# Altium schematic sheet User Interface.SchDoc: User Interface
size A4; Date: 2016/01/05; Author: Samuel López; DocumentNumber: 6; SheetNumber: 6; SheetTotal: 7; Project: H2H Main Board
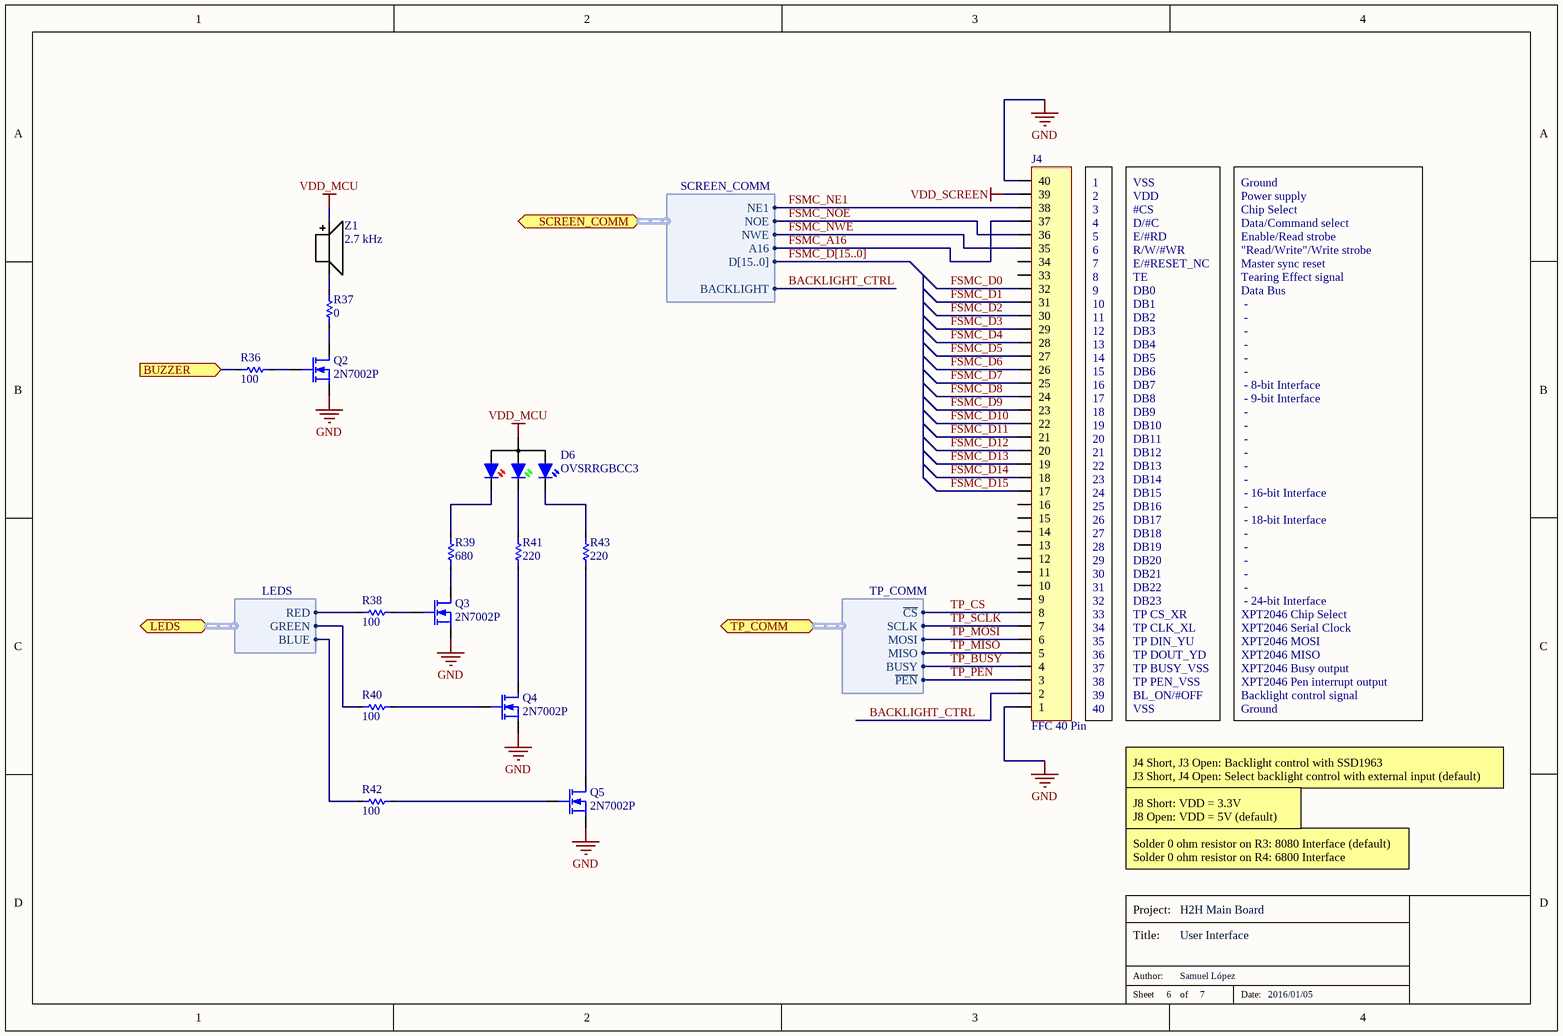
[diagram p0: User Interface.SchDoc]

## Parts
D6  OVSRRGBCC3  [OVSRRGBCC3/SIDE]
J4  FFC 40 Pin  [ER-CON40HB-2]
Q2  2N7002P  [2N7002P]
Q3  2N7002P  [2N7002P]
Q4  2N7002P  [2N7002P]
Q5  2N7002P  [2N7002P]
R36  100  [R0603]
R37  0  [R0603]
R38  100  [R0603]
R39  680  [R0603]
R40  100  [R0603]
R41  220  [R0603]
R42  100  [R0603]
R43  220  [R0603]
Z1  2.7 kHz  [KSSG74B16]

## Ports
BUZZER (in), LEDS (harness LEDS), SCREEN_COMM (harness SCREEN_COMM), TP_COMM (harness TP_COMM)

## Harnesses
SCREEN_COMM: NE1, NOE, NWE, A16, D[15..0], BACKLIGHT
TP_COMM: ~{CS}, SCLK, MOSI, MISO, BUSY, ~{PEN}
LEDS: RED, GREEN, BLUE

## Nets
GND: J4.1 J4.40 Q2.2(S) Q3.2(S) Q4.2(S) Q5.2(S)
VDD_MCU: D6.4(A) Z1.1(+)
VDD_SCREEN: J4.39
BACKLIGHT_CTRL: J4.2 ; port SCREEN_COMM.BACKLIGHT
BUZZER: R36.1 ; port BUZZER
FSMC_A16: J4.37 ; port SCREEN_COMM.A16
FSMC_D0: J4.32
FSMC_D1: J4.31
FSMC_D2: J4.30
FSMC_D3: J4.29
FSMC_D4: J4.28
FSMC_D5: J4.27
FSMC_D6: J4.26
FSMC_D7: J4.25
FSMC_D8: J4.24
FSMC_D9: J4.23
FSMC_D10: J4.22
FSMC_D11: J4.21
FSMC_D12: J4.20
FSMC_D13: J4.19
FSMC_D14: J4.18
FSMC_D15: J4.17
FSMC_NE1: J4.38 ; port SCREEN_COMM.NE1
FSMC_NOE: J4.36 ; port SCREEN_COMM.NOE
FSMC_NWE: J4.35 ; port SCREEN_COMM.NWE
TP_BUSY: J4.4 ; port TP_COMM.BUSY
TP_CS: J4.8 ; port TP_COMM.~{CS}
TP_MISO: J4.5 ; port TP_COMM.MISO
TP_MOSI: J4.6 ; port TP_COMM.MOSI
TP_PEN: J4.3 ; port TP_COMM.~{PEN}
TP_SCLK: J4.7 ; port TP_COMM.SCLK
NetD6_1: D6.1(K_R) R39.2
NetD6_2: D6.2(K_G) R41.1
NetD6_3: D6.3(K_B) R43.2
NetQ2_1: Q2.1(G) R36.2
NetQ2_3: Q2.3(D) R37.2
NetQ3_1: Q3.1(G) R38.2
NetQ3_3: Q3.3(D) R39.1
NetQ4_1: Q4.1(G) R40.2
NetQ4_3: Q4.3(D) R41.2
NetQ5_1: Q5.1(G) R42.1
NetQ5_3: Q5.3(D) R43.1
NetR37_1: R37.1 Z1.2(-)
NetR38_1: R38.1 ; port LEDS.RED
NetR40_1: R40.1 ; port LEDS.GREEN
NetR42_2: R42.2 ; port LEDS.BLUE

Not connected (* = marked no-connect by the designer): J4 9 10 11 12 13 14 15 16 33 34

## Buses and harness runs
bus FSMC_D[15..0]

## Notes on the sheet
- 1
  2
  3
  4
  5
  6
  7
  8
  9
  10
  11
  12
  13
  14
  15
  16
  17
  18
  19
  20
  21
  22
  23
  24
  25
  26
  27
  28
  29
  30
  31
  32
  33
  34
  35
  36
  37
  38
  39
  40
- VSS
  VDD
  #CS
  D/#C
  E/#RD
  R/W/#WR
  E/#RESET_NC
  TE
  DB0
  DB1
  DB2
  DB3
  DB4
  DB5
  DB6
  DB7
  DB8
  DB9
  DB10
  DB11
  DB12
  DB13
  DB14
  DB15
  DB16
  DB17
  DB18
  DB19
  DB20
  DB21
  DB22
  DB23
  TP CS_XR
  TP CLK_XL
  TP DIN_YU
  TP DOUT_YD
  TP BUSY_VSS
  TP PEN_VSS
  BL_ON/#OFF
  VSS
- Ground
  Power supply
  Chip Select
  Data/Command select
  Enable/Read strobe
  "Read/Write"/Write strobe
  Master sync reset
  Tearing Effect signal
  Data Bus
  -
  -
  -
  -
  -
  -
  - 8-bit Interface
  - 9-bit Interface
  -
  -
  -
  -
  -
  -
  - 16-bit Interface
  -
  - 18-bit Interface
  -
  -
  -
  -
  -
  - 24-bit Interface
  XPT2046 Chip Select
  XPT2046 Serial Clock
  XPT2046 MOSI
  XPT2046 MISO
  XPT2046 Busy output
  XPT2046 Pen interrupt output
  Backlight control signal
  Ground
- J4 Short, J3 Open: Backlight control with SSD1963
  J3 Short, J4 Open: Select backlight control with external input (default)
- J8 Short: VDD = 3.3V
  J8 Open: VDD = 5V (default)
- Solder 0 ohm resistor on R3: 8080 Interface (default)
  Solder 0 ohm resistor on R4: 6800 Interface
- Project:
- Title:
- Sheet
- Author:
- of
- Date:

## Library data of the parts
D6 = OVSRRGBCC3: LED - RGB, Top/Side-emmiting; Supplier 1: Digi-Key; Supplier Part Number 1: 365-1981-1-ND
J4 = ER-CON40HB-2: Conn - FFC/FPC, 40 Pin, 1.0mm Pitch, ZIF
Q2-Q5 = 2N7002P: Transistor - MOSFET, N-Channel, 60V, 300mA; Supplier 1: Digi-Key; Supplier Part Number 1: 568-5818-1-ND
R36-R43 = Resistor: Power: *
  R36 R38 R40 R42: Value: 100
  R37: Value: 0
  R39: Value: 680
  R41 R43: Value: 220
Z1 = KSSG74B16: Transductor - Buzzer 2.7 kHz; Supplier 1: Farnell; Supplier Part Number 1: 2215090; Resonant frequency: 2.7 kHz